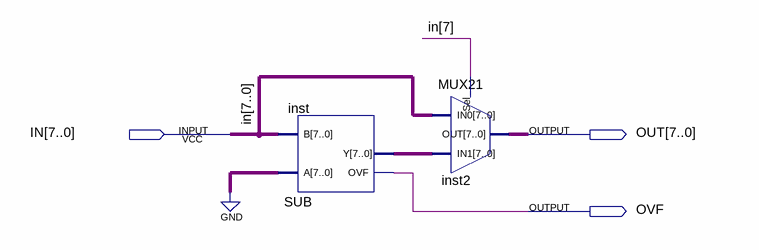
[diagram p0: schematic sheet]
// Quartus schematic ABS.bdf as structural Verilog: 2 symbols, 3 pins
module ABS (
  input  [7:0] IN,
  output [7:0] OUT,
  output OVF
);

  wire [7:0] inst_y;

  SUB inst (.A({8{1'b0}}), .B(IN), .Y(inst_y), .OVF(OVF));
  MUX21 inst2 (.Sel(IN[7]), .IN0(IN), .IN1(inst_y), .OUT(OUT));
endmodule
